# Altium project 驱动2.PrjPcb
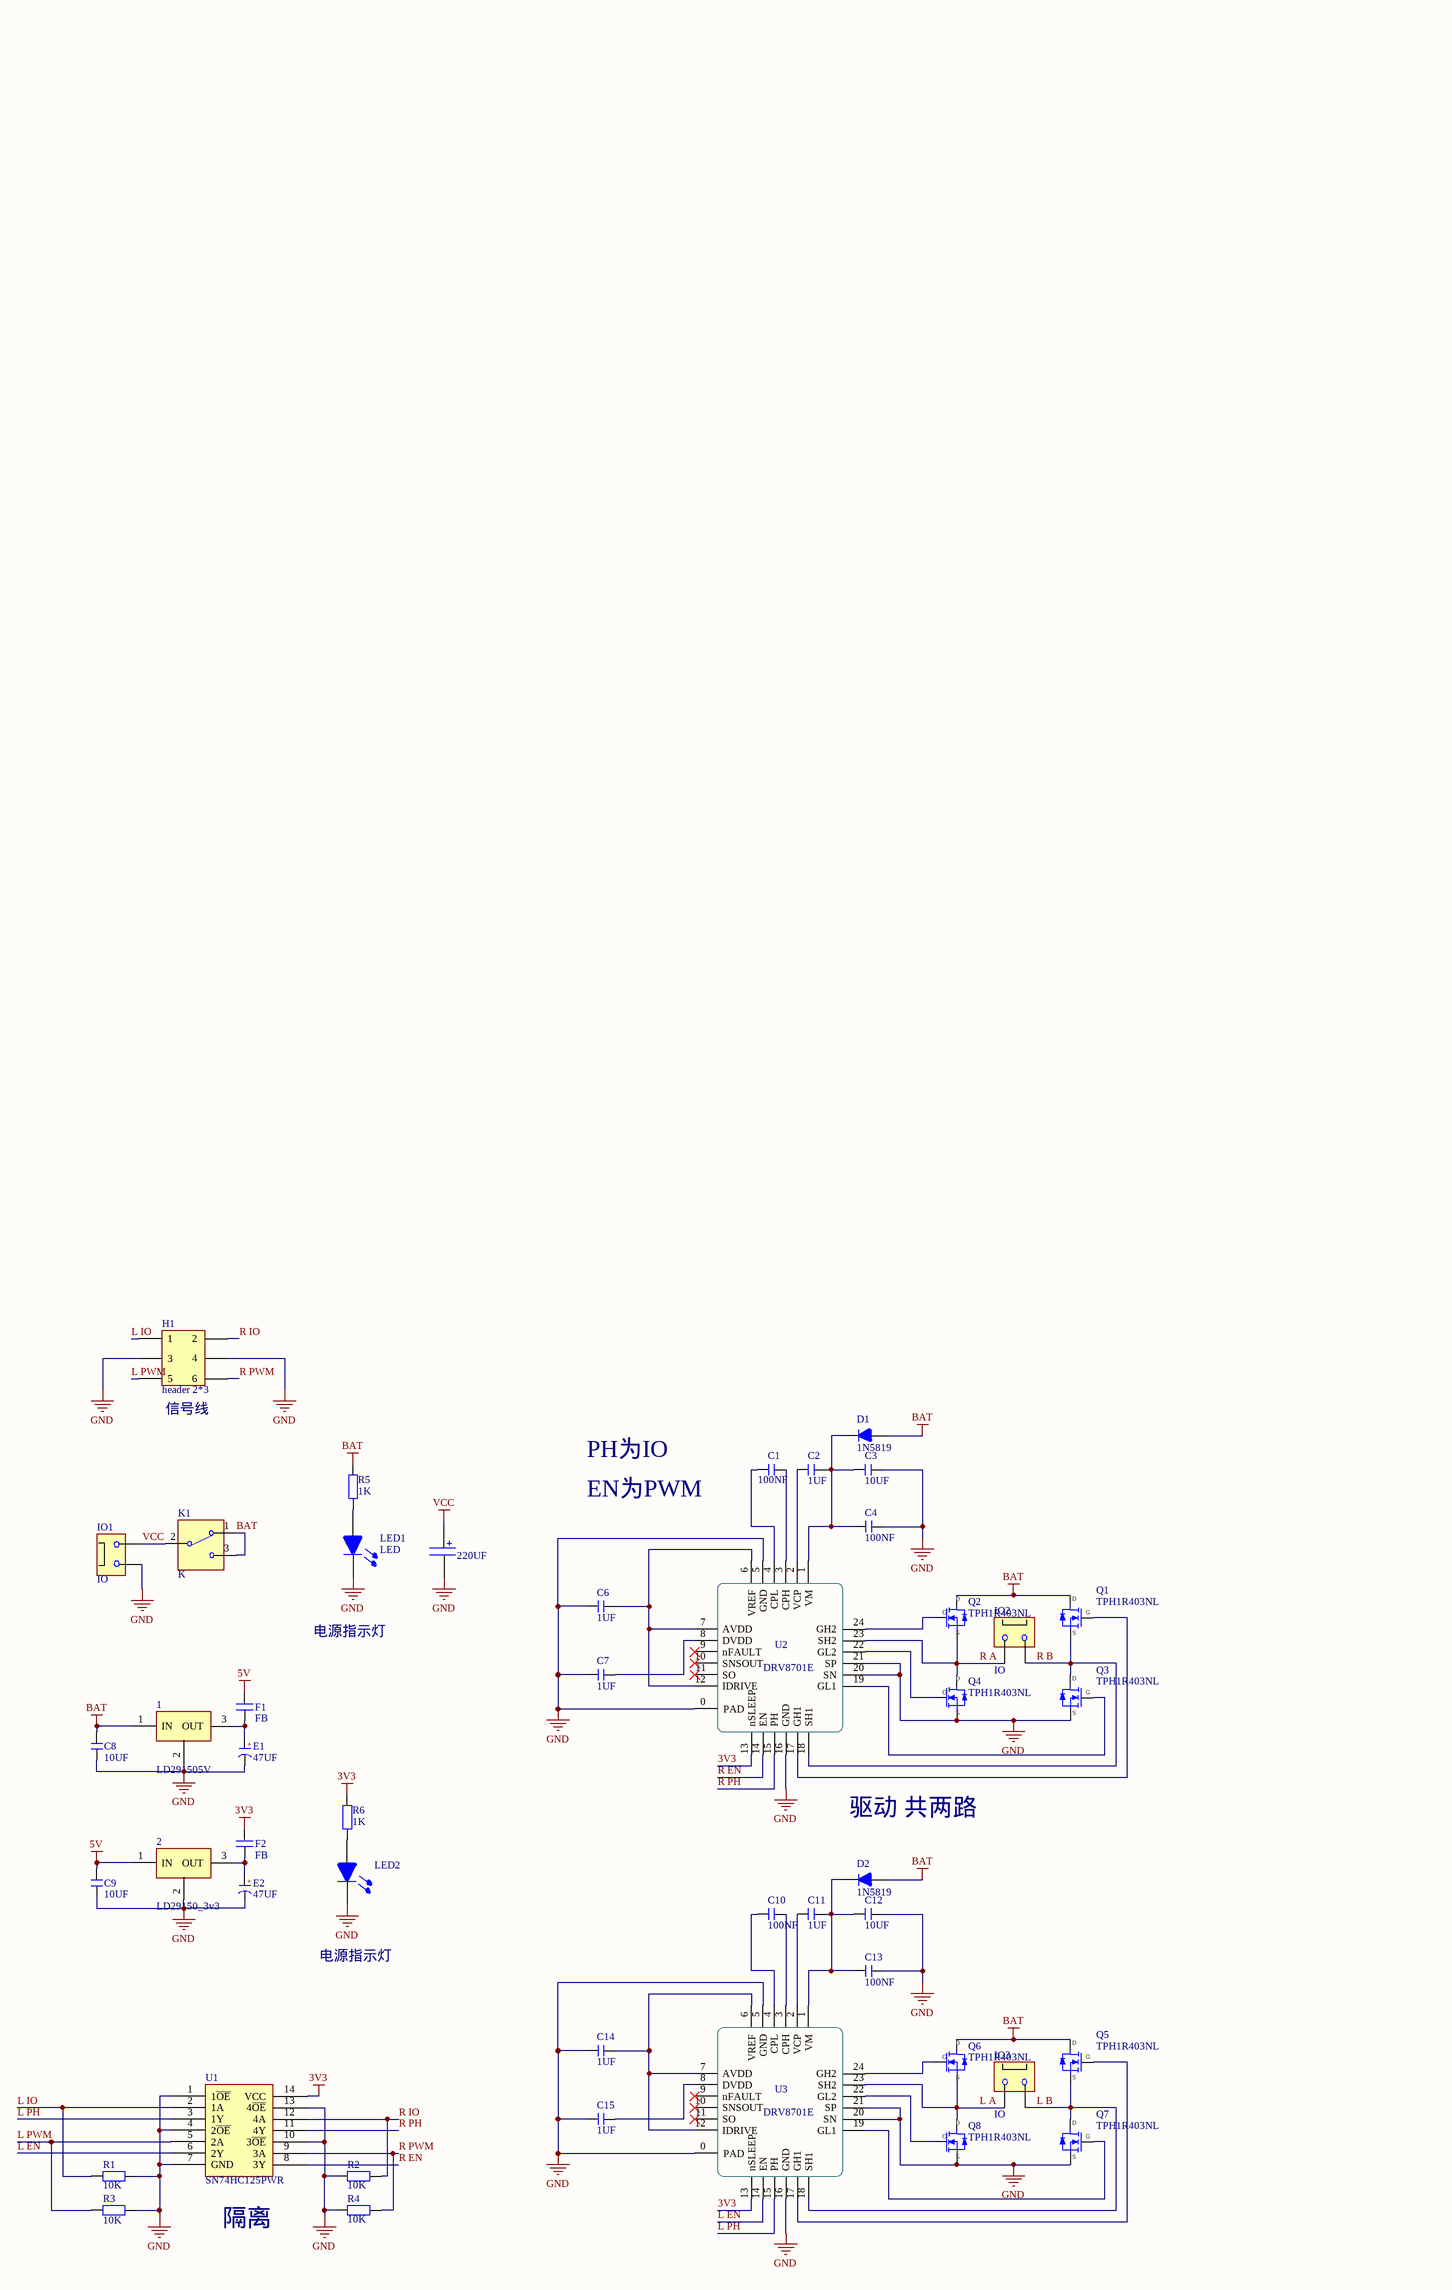
[diagram p0: 驱动2.SchDoc]
1 sheet, 47 parts. Net scope: global (net labels, ports and power ports of the same name join across sheets).
Board file: 驱动2.PcbDoc

## Sheet 驱动2.SchDoc
size A1; SheetNumber: 1; SheetTotal: 1

### Parts
1  LD291505V  [LC-TO-252-2]
2  LD29150_3v3  [LC-TO-252-2]
C1  100NF  [0603-C]
C2  1UF  [0603-C]
C3  10UF  [0603-C]
C4  100NF  [0603-C]
C5  220UF  [Cap electro 6_3x12_5x2_5mm]
C6  1UF  [0603-C]
C7  1UF  [0603-C]
C8  10UF  [0603-C]
C9  10UF  [0603-C]
C10  100NF  [0603-C]
C11  1UF  [0603-C]
C12  10UF  [0603-C]
C13  100NF  [0603-C]
C14  1UF  [0603-C]
C15  1UF  [0603-C]
D1  1N5819  [SMA]
D2  1N5819  [SMA]
E1  47UF  [A106C钽电容]
E2  47UF  [A106C钽电容]
F1  FB  [0603-C]
F2  FB  [0603-C]
H1  header 2*3  [HDR2.54-LI-2x3P]
IO1  IO  [XT30]
IO2  IO  [XT30]
IO3  IO  [XT30]
K1  K  [SW-SPDT-3A250V]
LED1  LED  [0603-LED-R]
LED2  LED  [0603-LED-R]  (value not drawn)
Q1  TPH1R403NL  [DFN5x6]
Q2  TPH1R403NL  [DFN5x6]
Q3  TPH1R403NL  [DFN5x6]
Q4  TPH1R403NL  [DFN5x6]
Q5  TPH1R403NL  [DFN5x6]
Q6  TPH1R403NL  [DFN5x6]
Q7  TPH1R403NL  [DFN5x6]
Q8  TPH1R403NL  [DFN5x6]
R1  value 10K  [LC-0603_R]  (hidden comment: Res2)
R2  value 10K  [LC-0603_R]  (hidden comment: Res2)
R3  value 10K  [LC-0603_R]  (hidden comment: Res2)
R4  value 10K  [LC-0603_R]  (hidden comment: Res2)
R5  value 1K  [LC-0603_R]  (hidden comment: Res2)
R6  value 1K  [LC-0603_R]  (hidden comment: Res2)
U1  SN74HC125PWR  [TSSOP14]
U2  DRV8701E  [QFN24-4x4]
U3  DRV8701E  [QFN24-4x4]

### Nets
3V3: F2.2 R6.1 U1.14(VCC) U2.13(nSLEEP) U3.13(nSLEEP)
5V: 2.1(IN) C9.2 F1.2
BAT: 1.1(IN) C8.2 D1.1(A) D2.1(A) K1.1 K1.3 Q1.1(D) Q2.1(D) Q5.1(D) Q6.1(D) R5.1
GND: 1.2(GND) 2.2(GND) C3.1 C4.2 C5.2 C6.1 C7.1 C8.1 C9.1 C12.1 C13.2 C14.1 C15.1 E1.2(K) E2.2(K) H1.3 H1.4 IO1.2 LED1.LED- LED2.LED- Q3.3(S) Q4.3(S) Q7.3(S) Q8.3(S) R1.1 R2.1 R3.2 R4.1 U1.1(1~{OE}) U1.4(2~{OE}) U1.7(GND) U1.10(3~{OE}) U1.13(4~{OE}) U2.0(PAD) U2.5(GND) U2.16(GND) U2.20(SN) U2.21(SP) U3.0(PAD) U3.5(GND) U3.16(GND) U3.20(SN) U3.21(SP)
VCC: C5.1 IO1.1 K1.2
L A: IO3.2 Q6.3(S) Q8.1(D) U3.23(SH2)
L B: IO3.1 Q5.3(S) Q7.1(D) U3.18(SH1)
L EN: U1.6(2Y) U3.14(EN)
L IO: H1.1 R1.2 U1.2(1A)
L PH: U1.3(1Y) U3.15(PH)
L PWM: H1.5 R3.1 U1.5(2A)
R A: IO2.2 Q2.3(S) Q4.1(D) U2.23(SH2)
R B: IO2.1 Q1.3(S) Q3.1(D) U2.18(SH1)
R EN: U1.8(3Y) U2.14(EN)
R IO: H1.2 R2.2 U1.12(4A)
R PH: U1.11(4Y) U2.15(PH)
R PWM: H1.6 R4.2 U1.9(3A)
Net1_3: 1.3(OUT) E1.1(A) F1.1
Net2_3: 2.3(OUT) E2.1(A) F2.1
NetC1_1: C1.1 U2.3(CPH)
NetC1_2: C1.2 U2.4(CPL)
NetC2_1: C2.1 C3.2 C4.1 D1.2(K) U2.1(VM)
NetC2_2: C2.2 U2.2(VCP)
NetC6_2: C6.2 U2.6(VREF) U2.7(AVDD) U2.12(IDRIVE)
NetC7_2: C7.2 U2.8(DVDD)
NetC10_1: C10.1 U3.3(CPH)
NetC10_2: C10.2 U3.4(CPL)
NetC11_1: C11.1 C12.2 C13.1 D2.2(K) U3.1(VM)
NetC11_2: C11.2 U3.2(VCP)
NetC14_2: C14.2 U3.6(VREF) U3.7(AVDD) U3.12(IDRIVE)
NetC15_2: C15.2 U3.8(DVDD)
NetLED1_LED+: LED1.LED+ R5.2
NetLED2_LED+: LED2.LED+ R6.2
NetQ1_2: Q1.2(G) U2.17(GH1)
NetQ2_2: Q2.2(G) U2.24(GH2)
NetQ3_2: Q3.2(G) U2.19(GL1)
NetQ4_2: Q4.2(G) U2.22(GL2)
NetQ5_2: Q5.2(G) U3.17(GH1)
NetQ6_2: Q6.2(G) U3.24(GH2)
NetQ7_2: Q7.2(G) U3.19(GL1)
NetQ8_2: Q8.2(G) U3.22(GL2)

Not connected (* = marked no-connect by the designer): U2 9(nFAULT)* 10(SNSOUT)* 11(SO)*; U3 9(nFAULT)* 10(SNSOUT)* 11(SO)*

### Notes on the sheet
- (near H1) 信号线
- PH为IO
- EN为PWM
- 电源指示灯
- 驱动 共两路
- (near U1) 隔离
- (in symbol C-CD) +

### Library data of the parts
1 = LD291505V: 5v转压
2 = LD29150_3v3: 转压3v3
C1-C4 C6-C15 = C: 无极性贴片电容; 版权归属: 源创客; BOM名称: 无极性贴片电容; 学习资源: www.ooocke.com
C5 = C+: 有极电容
D1 D2 = D: 二极管
E1 E2 = C-CD: 贴片钽电容; 版权归属: 源创客; BOM名称: 贴片钽电容; 学习资源: www.ooocke.com
F1 F2 = FB: 0欧磁珠
H1 = header 2*3: 编码器，PWM
IO1-IO3 = IO: 接口
K1 = K: 开关
Q1-Q8 = TPH1R403NL: 东芝 N沟 MOS
R1-R6 = Res2_3: 1K; Published: 8-Jun-2000; LatestRevisionDate: 17-Jul-2002; PackageReference: AXIAL-0.4; Publisher: Altium Limited; PackageDescription: Axial Device, Thru-Hole; 2 Leads; 0.4 in Pin Spacing
U2 U3 = DRV8701E: DRV8701E Ti全桥驱动芯片
U1 = SN74HC125PWR: Published: 8-Jun-2000; LatestRevisionDate: 13-Apr-2006; LatestRevisionNote: IPC-7351 Footprint Added.; DatasheetVersion: May-1997; PackageVersion: Mar-2000; PackageReference: DW020; Publisher: Altium Limited; PackageDescription: 20-Pin Plastic Small Outline Integrated Circuit 1.27 mm Pitch; Code_JEDEC: MS-013; Code_IPC: SOIC127P1030-20; ComponentLink1Description: Manufacturer Link; ComponentLink1URL: http://www.ti.com/; ComponentLink2Description: Datasheet; ComponentLink2URL: http://www-s.ti.com/sc/ds/sn74hc244.pdf